# EAGLE schematic max7219-displays (EAGLE 6.4)
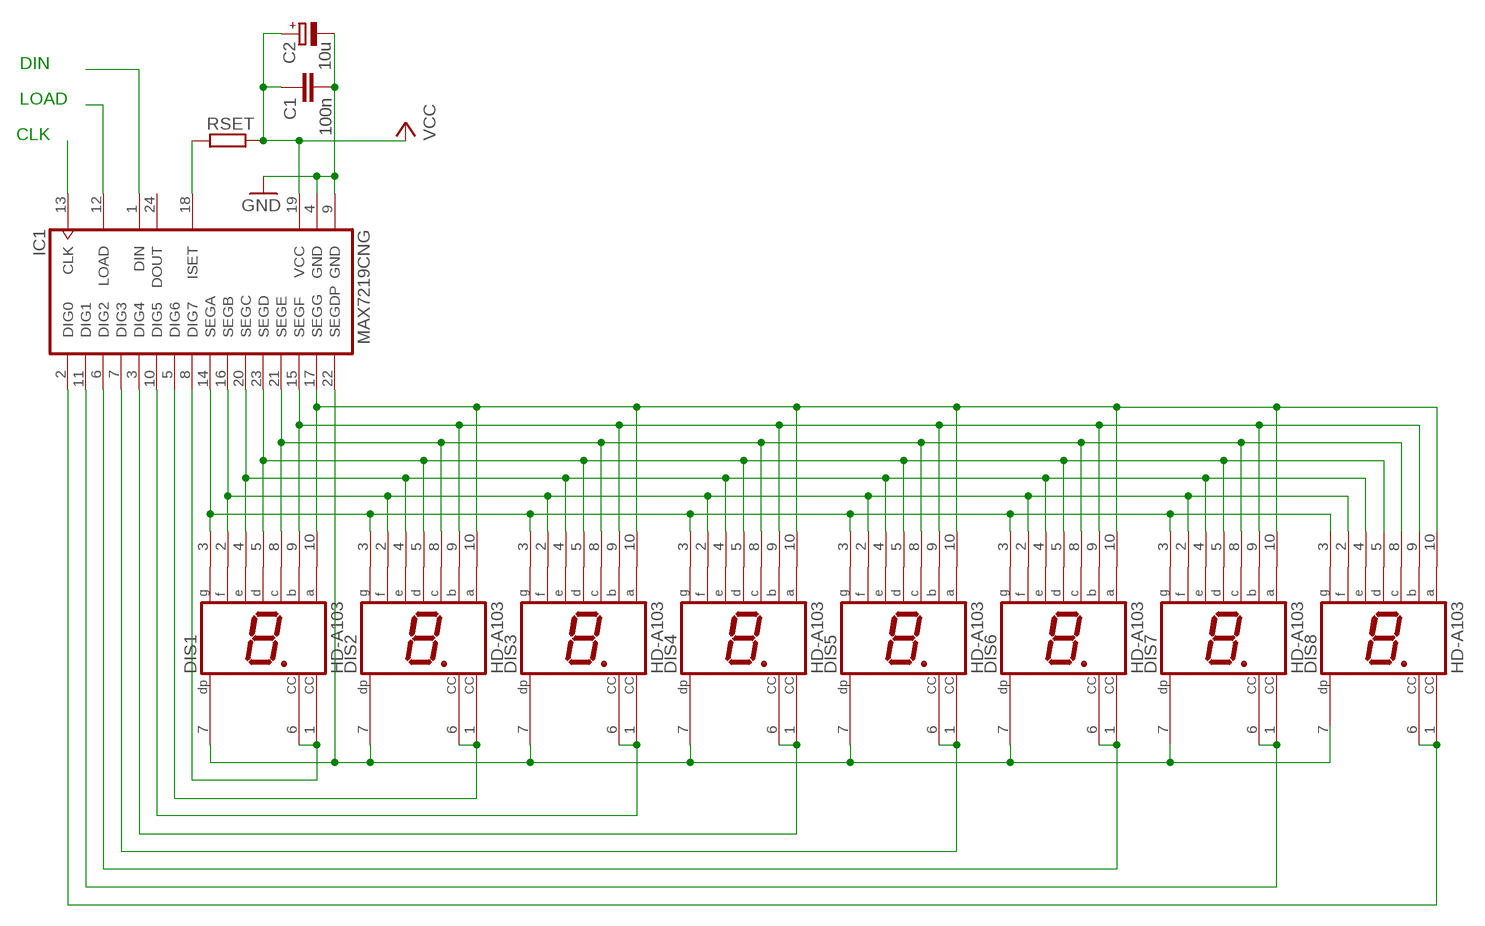
[diagram p0: schematic, sheet 1]

## Parts
C1  100n  C-EU025-024X044  [C025-024X044]
C2  10u  CPOL-EU139CLL-2R  [139CLL-2R]
DIS1  HD-A103  [HDSP-A]
DIS2  HD-A103  [HDSP-A]
DIS3  HD-A103  [HDSP-A]
DIS4  HD-A103  [HDSP-A]
DIS5  HD-A103  [HDSP-A]
DIS6  HD-A103  [HDSP-A]
DIS7  HD-A103  [HDSP-A]
DIS8  HD-A103  [HDSP-A]
IC1  MAX7219CNG  [DIL24-3]
RSET  R-EU_0204/7  [0204/7]

## Nets
GND: C1.2 C2.- IC1.4(GND) IC1.9(GND)
N$1: DIS1.10(A) DIS2.10(A) DIS3.10(A) DIS4.10(A) DIS5.10(A) DIS6.10(A) DIS7.10(A) DIS8.10(A) IC1.17(SEGG)
N$2: DIS1.9(B) DIS2.9(B) DIS3.9(B) DIS4.9(B) DIS5.9(B) DIS6.9(B) DIS7.9(B) DIS8.9(B) IC1.15(SEGF)
N$3: DIS1.8(C) DIS2.8(C) DIS3.8(C) DIS4.8(C) DIS5.8(C) DIS6.8(C) DIS7.8(C) DIS8.8(C) IC1.21(SEGE)
N$4: DIS1.5(D) DIS2.5(D) DIS3.5(D) DIS4.5(D) DIS5.5(D) DIS6.5(D) DIS7.5(D) DIS8.5(D) IC1.23(SEGD)
N$5: DIS1.4(E) DIS2.4(E) DIS3.4(E) DIS4.4(E) DIS5.4(E) DIS6.4(E) DIS7.4(E) DIS8.4(E) IC1.20(SEGC)
N$6: DIS1.2(F) DIS2.2(F) DIS3.2(F) DIS4.2(F) DIS5.2(F) DIS6.2(F) DIS7.2(F) DIS8.2(F) IC1.16(SEGB)
N$7: DIS1.3(G) DIS2.3(G) DIS3.3(G) DIS4.3(G) DIS5.3(G) DIS6.3(G) DIS7.3(G) DIS8.3(G) IC1.14(SEGA)
N$9: DIS8.1(CC) DIS8.6(CC) IC1.2(DIG0)
N$10: DIS7.1(CC) DIS7.6(CC) IC1.11(DIG1)
N$11: DIS6.1(CC) DIS6.6(CC) IC1.6(DIG2)
N$12: DIS5.1(CC) DIS5.6(CC) IC1.7(DIG3)
N$13: DIS4.1(CC) DIS4.6(CC) IC1.3(DIG4)
N$14: DIS3.1(CC) DIS3.6(CC) IC1.10(DIG5)
N$15: DIS2.1(CC) DIS2.6(CC) IC1.5(DIG6)
N$16: DIS1.1(CC) DIS1.6(CC) IC1.8(DIG7)
N$17: IC1.18(ISET) RSET.2
N$18: DIS1.7(DP) DIS2.7(DP) DIS3.7(DP) DIS4.7(DP) DIS5.7(DP) DIS6.7(DP) DIS7.7(DP) IC1.22(SEGDP)
N$19: IC1.1(DIN)
N$20: IC1.12(LOAD)
N$21: IC1.13(CLK)
VCC: C1.1 C2.+ IC1.19(VCC) RSET.1
Unconnected: DIS8.7(DP) IC1.24(DOUT)

## Notes on the sheet
- DIN
- LOAD
- CLK

## Library data of the parts
C1 = resistor:C-EU: CAPACITOR, European symbol
C2 = resistor:CPOL-EU: POLARIZED CAPACITOR, European symbol
DIS1-DIS8 = display-hp:HD-A103: LED DISPLAY 1-character 7 segment, decimal point right; OC_FARNELL: unknown; OC_NEWARK: unknown
IC1 = maxim:MAX7219CNG: LED DISPLAY DRIVER; MF: MAXIM; MPN: MAX7219CNG; OC_FARNELL: 1523914; OC_NEWARK: 34C4018
RSET = resistor:R-EU_: RESISTOR, European symbol